# EAGLE design D1 - LCD TH Screws (EAGLE 9.5.2)
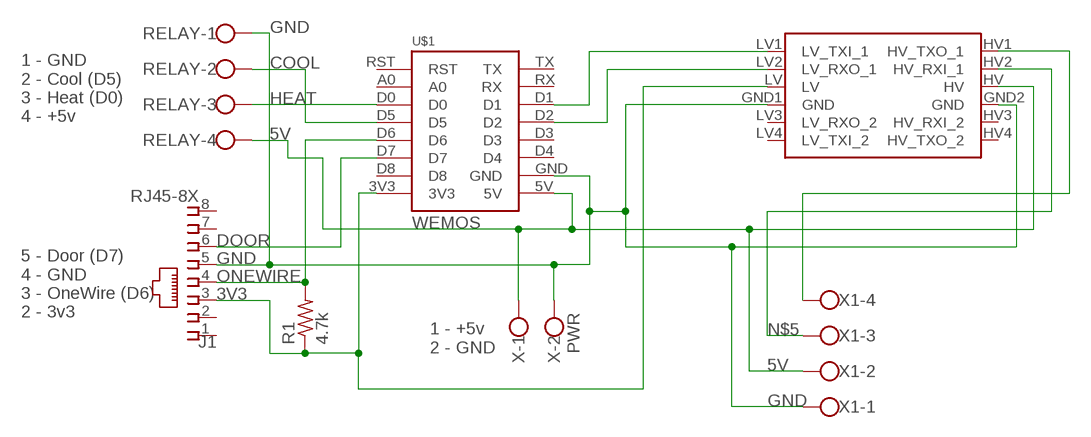
[diagram p0: schematic, sheet 1]

## Parts
J1  RJ45-8X  [RJ45-NO-SHIELD]
R1  4.7k  R-US_0309/12  [0309/12]
RELAY  W237-4  [W237-4]
U$1  WEMOS  [WEMOS]
U$3  SPARKFUN_LOGIC_LEVEL_CONVERTER  [SPARKFUN_LOGIC_LEVEL_CONVERTER]
X  PWR  W237-102  [W237-102]
X1  W237-4  [W237-4]

## Nets
3V3 [3v]: J1.3 R1.1 U$1.3V3 U$3.LV
5V [5v]: RELAY.4 U$1.5V U$3.HV X1.2 X.1
COOL: RELAY.2 U$1.D5
DOOR: J1.6 U$1.D7
GND [Gnd]: J1.5 RELAY.1 U$1.GND U$3.GND1(GND) U$3.GND2(GND) X1.1 X.2
HEAT: RELAY.3 U$1.D0
N$1: U$1.D1 U$3.LV1(LV_TXI_1)
N$2: U$1.D2 U$3.LV2(LV_RXO_1)
N$4: U$3.HV1(HV_TXO_1) X1.4
N$5: U$3.HV2(HV_RXI_1) X1.3
ONEWIRE: J1.4 R1.2 U$1.D6
Unconnected: J1.1 J1.2 J1.7 J1.8 U$1.A0 U$1.D3 U$1.D4 U$1.D8 U$1.RST U$1.RX U$1.TX U$3.HV3(HV_RXI_2) U$3.HV4(HV_TXO_2) U$3.LV3(LV_RXO_2) U$3.LV4(LV_TXI_2)

## Notes on the sheet
- 1 - GND
  2 - Cool (D5)
  3 - Heat (D0)
  4 - +5v
- 5 - Door (D7)
  4 - GND
  3 - OneWire (D6) 
  2 - 3v3
- 1 - +5v
  2 - GND

## Library data of the parts
J1 = con-tycoelectronics:RJ45: CORCOM Modular RJ Jacks No Shield Source: www.tycoelectronics.com .. ENG_DS_1654001_1099_RJ_L_0507.pdf; MPN: RJ45-8X; OC_FARNELL: unknown; OC_NEWARK: 16R6101
R1 = rcl:R-US_: RESISTOR, American symbol; SPICEPREFIX: R
RELAY X1 = con-wago-500:W237-4: WAGO SCREW CLAMP; OC_FARNELL: unknown; OC_NEWARK: unknown
U$1 = 1455413453956-wemos:WEMOS
U$3 = SparkFun-Boards:SPARKFUN_LOGIC_LEVEL_CONVERTER: SparkFun Logic Level Converter -Bi-Directional This is the mechnical outline for the 3.3V - 5V bi directional logic level converter. *Note, the "LOCK" Package has the header pins staggered by an offset of 5 mils (off center line), so that when you slide a row of standard 0.1" headers into the PTH pads, it will hold position vertically. See the follwing turorial for more information on this type of special footprints: Sneaky Footprints <https://www.sparkfun.com/tutorials/114> SparkFun Products: SparkFun Logic Level Converter - Bi-Directional <https://www.sparkfun.com/products/12009>
X = con-wago-500:W237-102: WAGO SCREW CLAMP; MPN: 237-102; OC_FARNELL: unknown; OC_NEWARK: 70K9898

## Net classes
0 default: width 0.305 mm, clearance 0.305 mm
1 5v: width 0.406 mm, clearance 0.406 mm
2 3v: width 0.406 mm, clearance 0.406 mm
3 Gnd: width 0.406 mm, clearance 0.406 mm

## Board
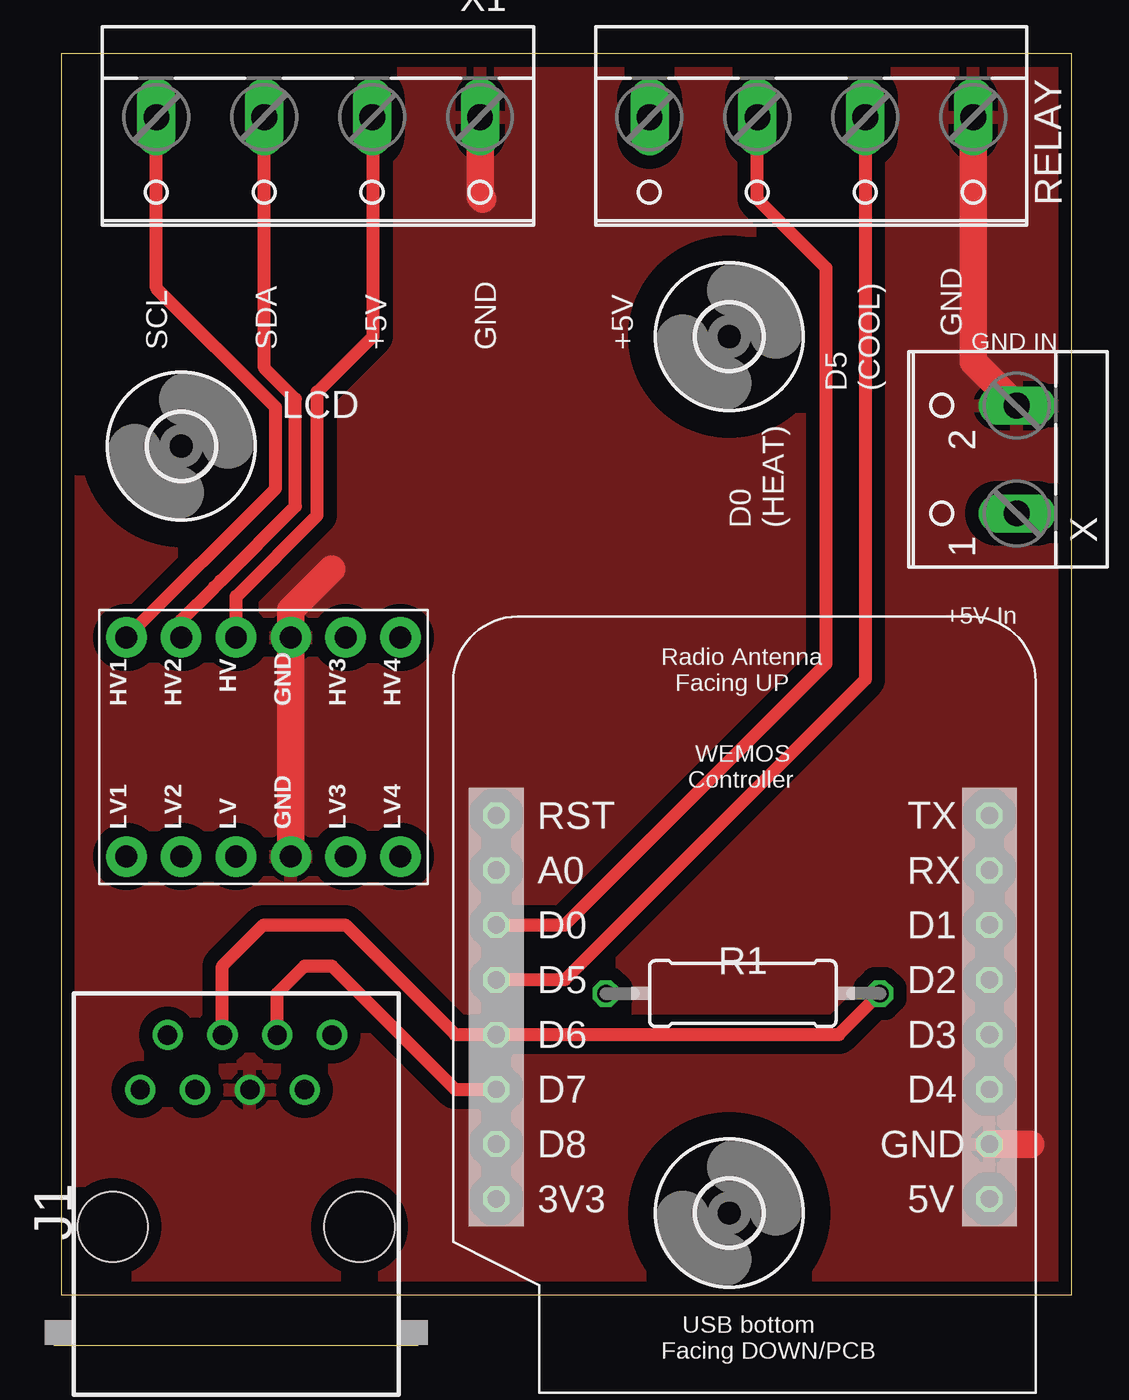
[diagram p1: board, top side]
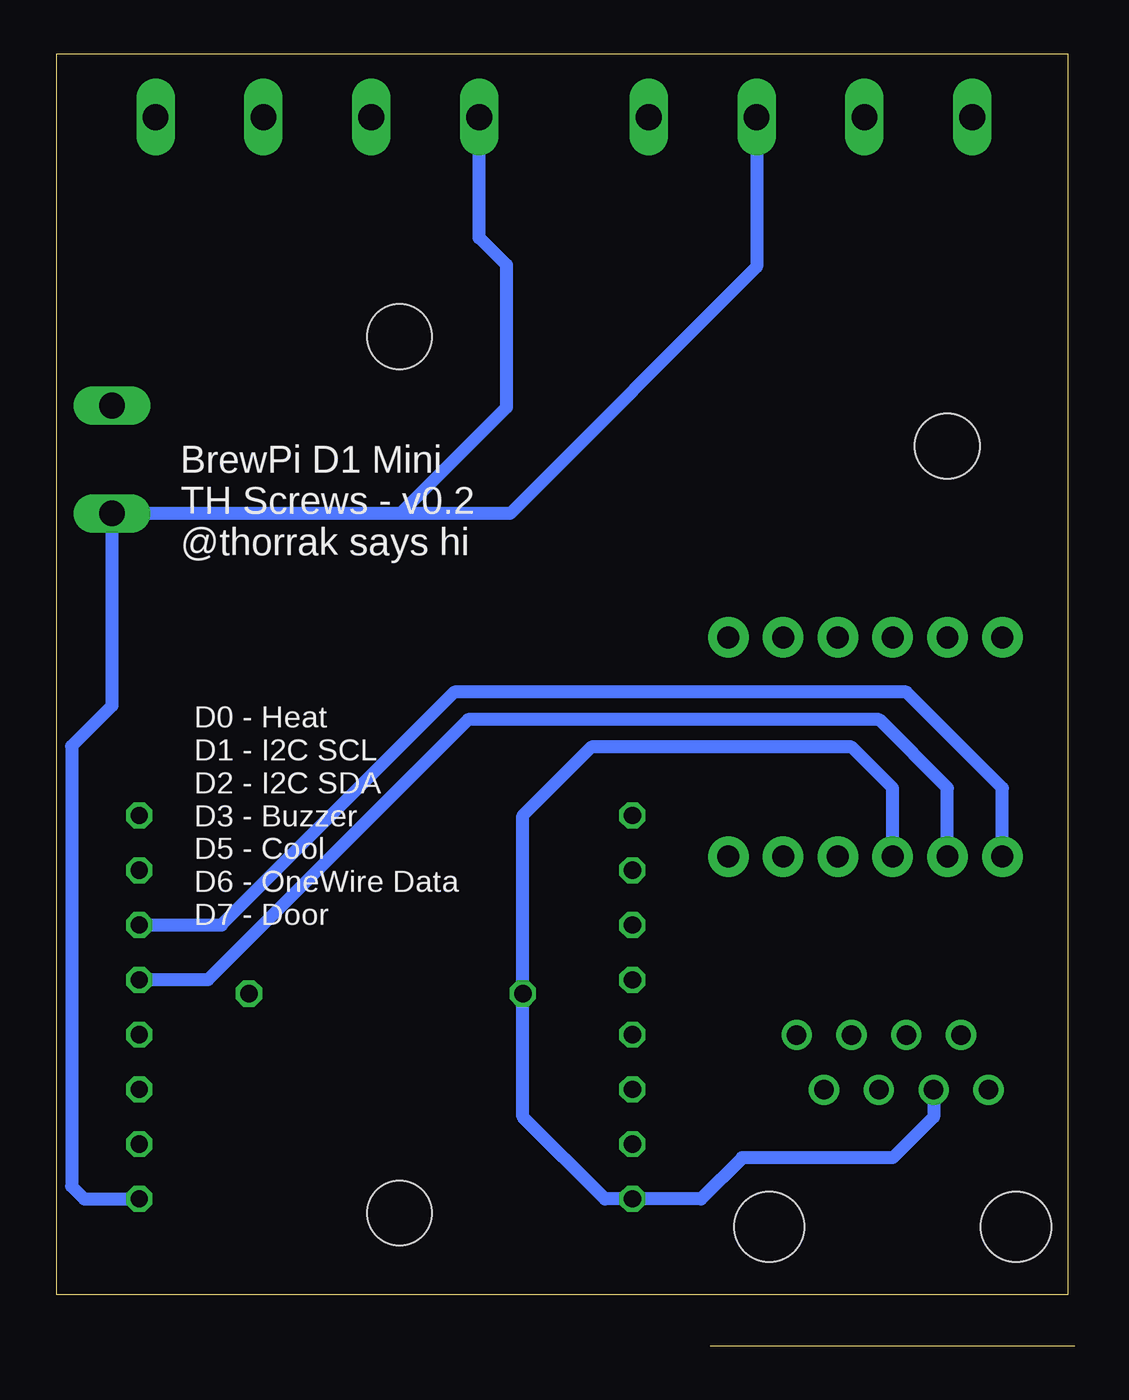
[diagram p2: board, bottom side, seen from below]

Size 46.85 x 57.54 mm. Coordinates in mm from the lower left corner, seen from the top.
Outline: 46.85,0 46.85,57.54 0,57.54 0,0 46.85,0
Copper layers (1*16): Top 0.0356mm / dielectric 1.5011mm / Bottom 0.0356mm
Design rules "PCBs_io": minimum track width 6mil, minimum drill 13mil, track to track 6mil, track to pad 6mil, pad to pad 6mil, via to via 6mil, smd to smd 6mil, copper to edge 15mil, drill to drill 6mil, minimum pad ring 7mil, minimum via ring 7mil, stop-mask expansion 3mil, vias tented up to drill 0mil, thermal gap 10mil

### Footprints (pad centres in the part's own frame; a part is rotated, then mirrored left to right if it is on the bottom)
RJ45-NO-SHIELD = drill 0.9 pad 1.4: 1 -4.445,6.35; 2 -3.175,8.89; 3 -1.905,6.35; 4 -0.635,8.89; 5 0.635,6.35; 6 1.905,8.89; 7 3.175,6.35; 8 4.445,8.89 | hole 3.251: -5.715,0; 5.715,0
0309/12 = drill 0.813 octagon: 1 -6.35,0; 2 6.35,0
W237-4 = drill 1.194 long: 1 -7.5,-1.27; 2 -2.5,-1.27; 3 2.5,-1.27; 4 7.5,-1.27
WEMOS = drill 0.8 octagon: 3V3 0,0; 5V 22.86,0; A0 0,15.24; D0 0,12.7; D1 22.86,12.7; D2 22.86,10.16; D3 22.86,7.62; D4 22.86,5.08; D5 0,10.16; D6 0,7.62; D7 0,5.08; D8 0,2.54; GND 22.86,2.54; RST 0,17.78; RX 22.86,15.24; TX 22.86,17.78
3,0 = hole 3: 0,0
SPARKFUN_LOGIC_LEVEL_CONVERTER = drill 1.016 pad 1.88: GND1 -5.08,-1.27; GND2 5.08,-1.27; HV 5.08,1.27; HV1 5.08,6.35; HV2 5.08,3.81; HV3 5.08,-3.81; HV4 5.08,-6.35; LV -5.08,1.27; LV1 -5.08,6.35; LV2 -5.08,3.81; LV3 -5.08,-3.81; LV4 -5.08,-6.35
W237-102 = drill 1.194 long: 1 -2.5,-1.27; 2 2.5,-1.27

### Placement (x,y rotation side)
J1  8.11,3.15 0 top
R1  31.6,13.97 0 top
RELAY  34.77,53.34 180 top
U$1  20.17,4.45 0 top
U$2  [3,0]  5.57,39.35 0 top
U$3  9.38,25.4 90 top
U$4  [3,0]  30.97,3.79 0 top
U$5  [3,0]  30.97,44.43 0 top
X  43.03,38.73 90 top
X1  11.91,53.34 180 top

### Tracks (layer width: path | path; a pad name or v marks a point on that pad's centre or on a via)
3V3
  Bottom 0.61: J1.3 6.21,8.25 8.11,6.35 15.09,6.35 17,4.45 U$1.3V3 21.44,4.45 25.25,8.26 R1.1 25.25,22.23 22.08,25.4 10.01,25.4 8.11,23.5 U$3.LV
5V
  Top 0.61: X1.2 14.46,54.57 14.46,44.45 11.87,41.86 11.87,36.15 8.11,32.38 U$3.HV
  Bottom 0.61: X1.2 14.41,47.66 25.85,36.23 30.93,36.23 | 30.93,36.23 X.1 44.3,27.3 46.16,25.44 46.16,5.04 45.57,4.45 U$1.5V | 30.93,36.23 26.01,41.16 26.01,47.74 27.28,49.02 RELAY.4
COOL
  Top 0.61: RELAY.2 37.27,28.54 23.35,14.61 U$1.D5
DOOR
  Top 0.61: J1.6 10.01,13.97 11.28,15.24 12.55,15.24 18.27,9.53 U$1.D7
GND
  Top 1.27: U$3.GND1 U$3.GND2 10.64,31.75 12.55,33.66 | X1.1 19.42,50.92 19.54,50.8 | RELAY.1 42.27,43.26 X.2 | U$1.GND 44.94,6.99
  pour Top (isolate 0.61): 0.1,57.15 46.84,57.15 46.84,0 0.1,0
HEAT
  Top 0.61: U$1.D0 23.35,17.14 35.45,29.25 35.45,47.62 32.27,50.8 RELAY.3
N$1
  Bottom 0.61: U$1.D1 39.22,17.14 28.43,27.94 7.47,27.94 3.02,23.5 U$3.LV1
N$2
  Bottom 0.61: U$1.D2 39.86,14.61 27.79,26.67 8.74,26.67 5.56,23.5 U$3.LV2
N$4
  Top 0.61: X1.4 4.42,46.68 9.94,41.16 9.94,37.39 U$3.HV1
N$5
  Top 0.61: X1.3 9.41,42.98 10.85,41.54 10.85,36.57 7.39,33.1 7.09,32.81 5.56,31.28 U$3.HV2
ONEWIRE
  Top 0.61: J1.4 7.47,15.24 9.38,17.14 13.19,17.14 18.27,12.06 U$1.D6 36.05,12.06 R1.2

### Text on the board
tPlace: SCL | SDA | +5V | GND | +5V | GND | GND IN | D5 / (COOL) | D0 / (HEAT) | +5V In
tNames: LCD
bNames: BrewPi D1 Mini / TH Screws - v0.2 / @thorrak says hi | D0 - Heat / D1 - I2C SCL / D2 - I2C SDA / D3 - Buzzer / D5 - Cool / D6 - OneWire Data / D7 - Door